# EAGLE design rev0.1 (EAGLE 7.2.0)
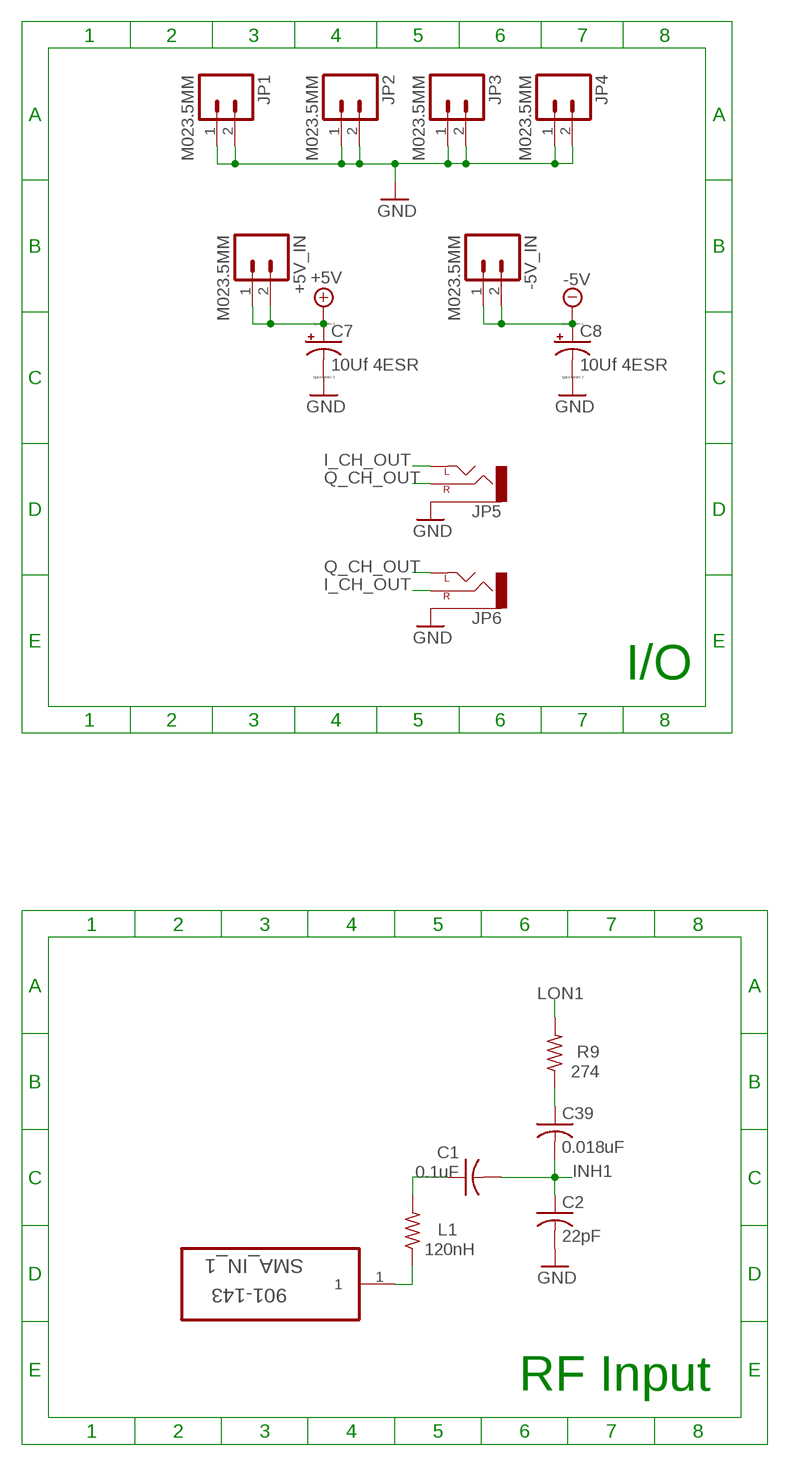
[diagram p0: schematic, sheet 1, part 1 of 2]
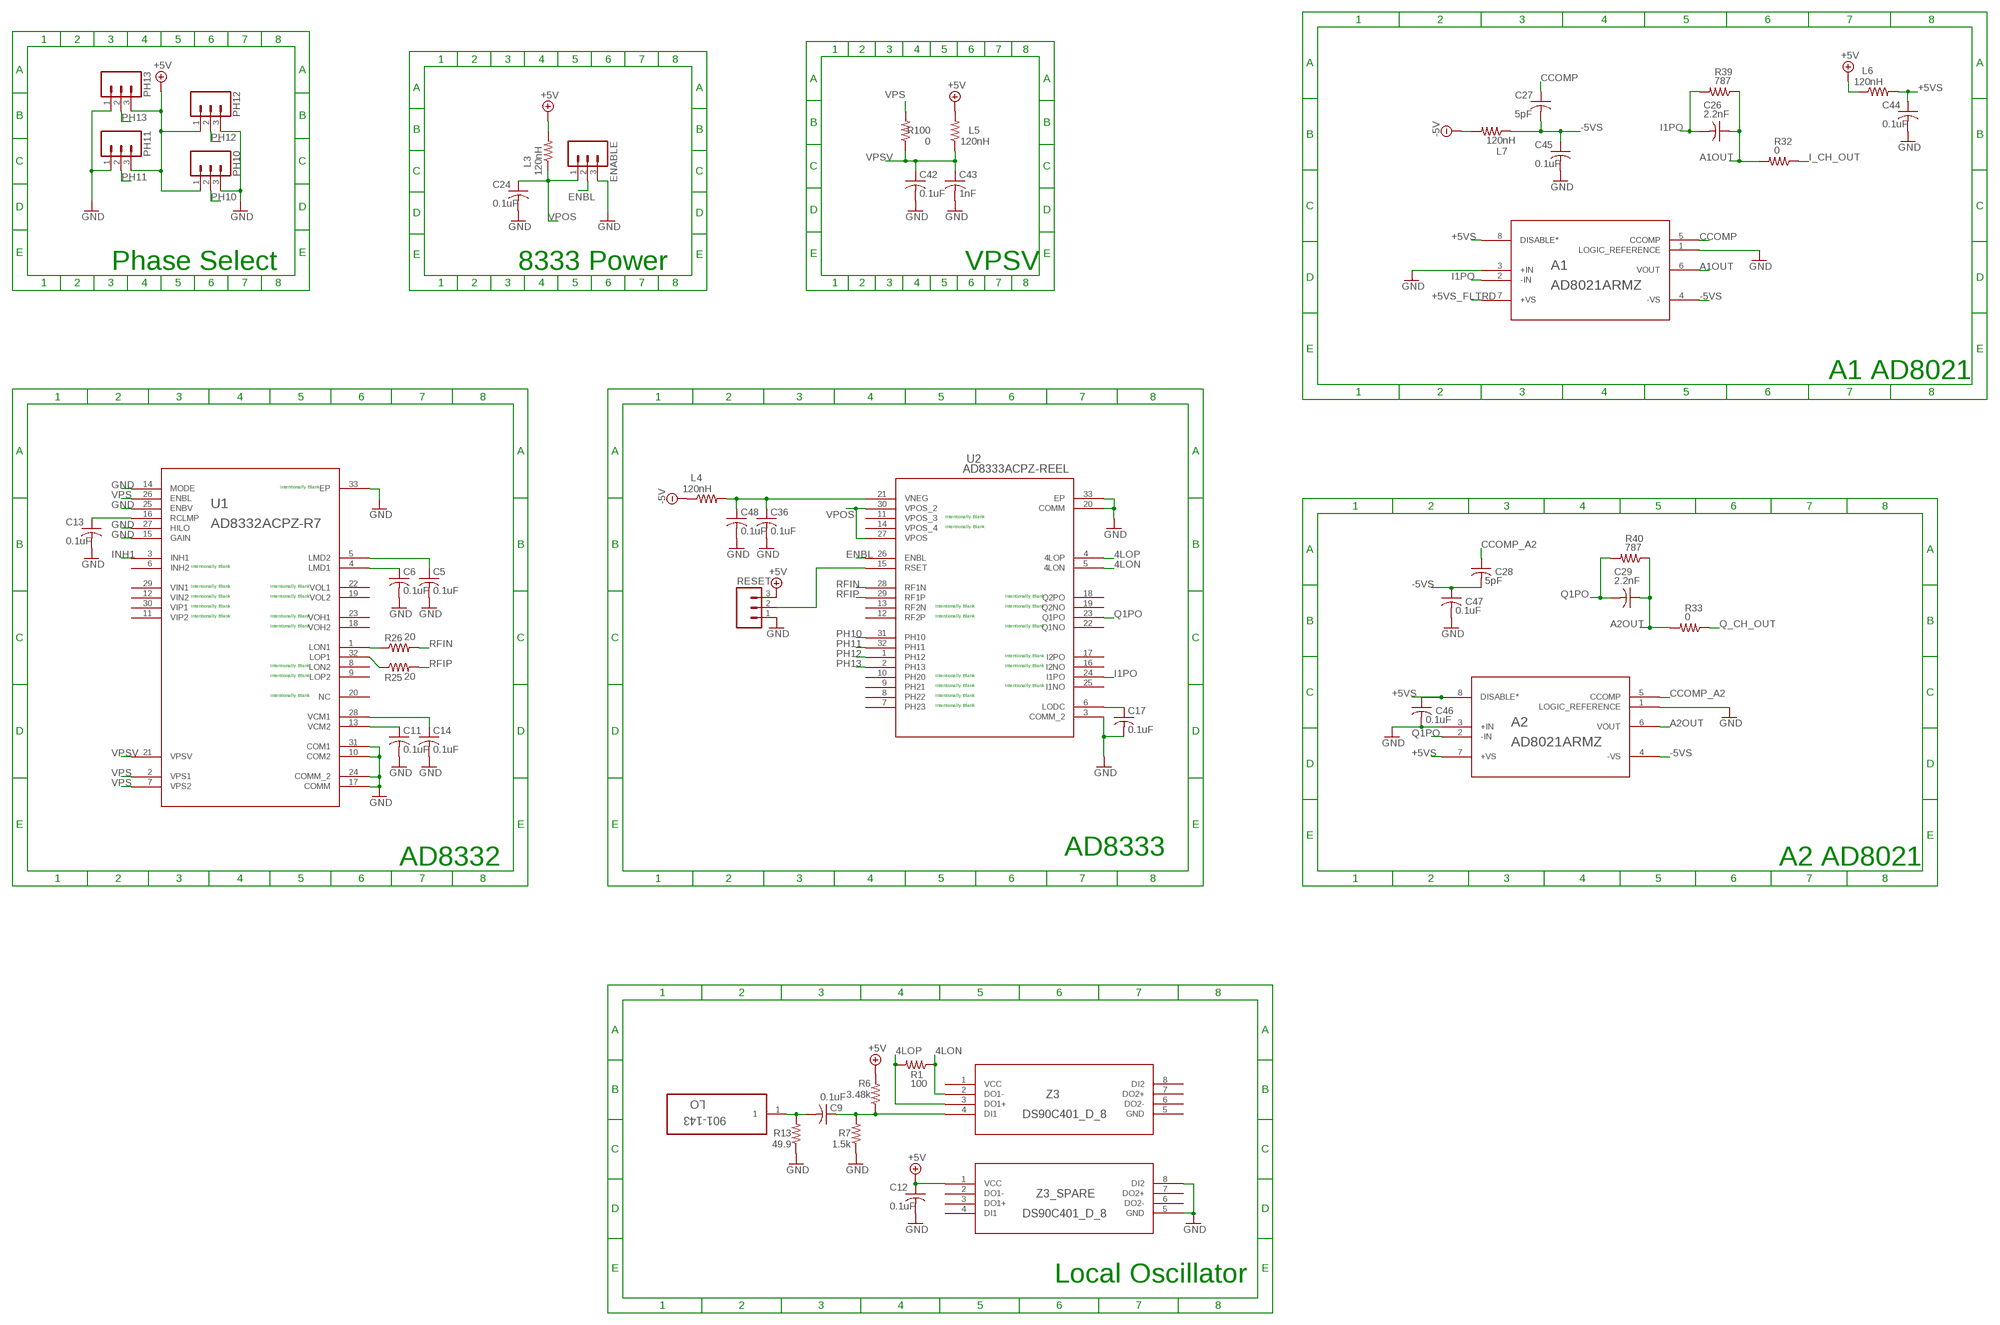
[diagram p1: schematic, sheet 1, part 2 of 2]

## Parts
+5V_IN  M023.5MM  [SCREWTERMINAL-3.5MM-2]
-5V_IN  M023.5MM  [SCREWTERMINAL-3.5MM-2]
A1  AD8021ARMZ  [RM_8]
A2  AD8021ARMZ  [RM_8]
C1  0.1uF  C-USC1206  [C1206]
C2  22pF  C-USC1206  [C1206]
C5  0.1uF  C-USC1206  [C1206]
C6  0.1uF  C-USC1206  [C1206]
C7  10Uf 4ESR  CPOL-USCT3216  [CT3216]
C8  10Uf 4ESR  CPOL-USCT3216  [CT3216]
C9  0.1uF  C-USC1206  [C1206]
C11  0.1uF  C-USC1206  [C1206]
C12  0.1uF  C-USC1206  [C1206]
C13  0.1uF  C-USC1206  [C1206]
C14  0.1uF  C-USC1206  [C1206]
C17  0.1uF  C-USC1206  [C1206]
C24  0.1uF  C-USC1206  [C1206]
C26  2.2nF  C-USC1206  [C1206]
C27  5pF  C-USC1206  [C1206]
C28  5pF  C-USC1206  [C1206]
C29  2.2nF  C-USC1206  [C1206]
C36  0.1uF  C-USC1206  [C1206]
C39  0.018uF  C-USC1206  [C1206]
C42  0.1uF  C-USC1206  [C1206]
C43  1nF  C-USC1206  [C1206]
C44  0.1uF  C-USC1206  [C1206]
C45  0.1uF  C-USC1206  [C1206]
C46  0.1uF  C-USC1206  [C1206]
C47  0.1uF  C-USC1206  [C1206]
C48  0.1uF  C-USC1206  [C1206]
ENABLE  M03PTH  [1X03]
JP1  M023.5MM  [SCREWTERMINAL-3.5MM-2]
JP2  M023.5MM  [SCREWTERMINAL-3.5MM-2]
JP3  M023.5MM  [SCREWTERMINAL-3.5MM-2]
JP4  M023.5MM  [SCREWTERMINAL-3.5MM-2]
JP5  AUDIO-JACKPTH  [AUDIO-JACK]
JP6  AUDIO-JACKPTH  [AUDIO-JACK]
L1  120nH  R-US_R0603  [R0603]
L3  120nH  R-US_R0603  [R0603]
L4  120nH  R-US_R0603  [R0603]
L5  120nH  R-US_R0603  [R0603]
L6  120nH  R-US_R0603  [R0603]
L7  120nH  R-US_R0603  [R0603]
LO  901-143  [AMPHENOL_901-143]
PH10  M03PTH  [1X03]
PH11  M03PTH  [1X03]
PH12  M03PTH  [1X03]
PH13  M03PTH  [1X03]
R1  100  R-US_R1206  [R1206]
R6  3.48k  R-US_R1206  [R1206]
R7  1.5k  R-US_R1206  [R1206]
R9  274  R-US_R1206  [R1206]
R13  49.9  R-US_R1206  [R1206]
R25  20  R-US_R1206  [R1206]
R26  20  R-US_R1206  [R1206]
R32  0  R-US_R1206  [R1206]
R33  0  R-US_R1206  [R1206]
R39  787  R-US_R1206  [R1206]
R40  787  R-US_R1206  [R1206]
R100  0  R-US_R1206  [R1206]
RESET  M03PTH  [1X03]
SMA_IN_1  901-143  [AMPHENOL_901-143]
U1  AD8332ACPZ-R7  [CP_32_2]
U2  AD8333ACPZ-REEL  [CP_32_2]
Z3  DS90C401_D_8  [M08A]
Z3_SPARE  DS90C401_D_8  [M08A]

## Nets
4LON: R1.1 U2.5(4LON) Z3.2(DO1-)
4LOP: R1.2 U2.4(4LOP) Z3.3(DO1+)
+5V: +5V_IN.1 +5V_IN.2 C7.-(+) C12.1 L3.2 L5.2 L6.1 PH10.1 PH11.3 PH12.1 PH13.3 R6.2 RESET.3 Z3_SPARE.1(VCC)
+5VS: A1.8(DISABLE*) A2.7(+VS) A2.8(DISABLE*) C44.1 C46.1 L6.2
+5VS_FLTRD: A1.7(+VS)
-5V: -5V_IN.1 -5V_IN.2 C8.-(+) L4.1 L7.2
-5VS: A1.4(-VS) A2.4(-VS) C27.2 C28.2 C45.1 C47.1 L7.1
A1OUT: A1.6(VOUT) C26.1 R32.2 R39.1
A2OUT: A2.6(VOUT) C29.1 R33.2 R40.1
CCOMP: A1.5(CCOMP) C27.1
CCOMP_A2: A2.5(CCOMP) C28.1
ENBL: ENABLE.2 U2.26(ENBL)
GND: A1.1(LOGIC_REFERENCE) A1.3(+IN) A2.1(LOGIC_REFERENCE) A2.3(+IN) C2.2 C5.2 C6.2 C7.+(-) C8.+(-) C11.2 C12.2 C13.2 C14.2 C17.2 C24.2 C36.2 C42.2 C43.2 C44.2 C45.2 C46.2 C47.2 C48.2 ENABLE.3 JP1.1 JP1.2 JP2.1 JP2.2 JP3.1 JP3.2 JP4.1 JP4.2 JP5.SLEEVE JP6.SLEEVE PH10.3 PH11.1 PH12.3 PH13.1 R7.1 R13.1 RESET.1 U1.10(COM2) U1.14(MODE) U1.15(GAIN) U1.17(COMM) U1.24(COMM_2) U1.25(ENBV) U1.27(HILO) U1.31(COM1) U1.33(EP) U2.3(COMM_2) U2.20(COMM) U2.33(EP) Z3_SPARE.5(GND) Z3_SPARE.8(DI2)
I1PO: A1.2(-IN) C26.2 R39.2 U2.24(I1PO)
I_CH_OUT: JP5.TIP(LEFT) JP6.RING(RIGHT) R32.1
INH1: C1.2 C2.1 C39.2 U1.3(INH1)
LMD1: C6.1 U1.4(LMD1)
LMD2: C5.1 U1.5(LMD2)
LON1: R9.2 R26.1 U1.1(LON1)
LOP1: R25.1 U1.32(LOP1)
N$1: C11.1 U1.13(VCM2)
N$2: C14.1 U1.28(VCM1)
N$3: C13.1 U1.16(RCLMP)
N$4: C1.1 L1.2
N$5: C9.1 R6.1 R7.2 Z3.4(DI1)
N$6: C39.1 R9.1
N$7: L1.1 SMA_IN_1.1
N$8: C9.2 LO.1 R13.2
N$9: C36.1 C48.1 L4.2 U2.21(VNEG)
N$10: C17.1 U2.6(LODC)
N$11: RESET.2 U2.15(RSET)
PH10: PH10.2 U2.31(PH10)
PH11: PH11.2 U2.32(PH11)
PH12: PH12.2 U2.1(PH12)
PH13: PH13.2 U2.2(PH13)
Q1PO: A2.2(-IN) C29.2 R40.2 U2.23(Q1PO)
Q_CH_OUT: JP5.RING(RIGHT) JP6.TIP(LEFT) R33.1
RFIN: R26.2 U2.28(RF1N)
RFIP: R25.2 U2.29(RF1P)
VPOS: C24.1 ENABLE.1 L3.1 U2.27(VPOS) U2.30(VPOS_2)
VPS: R100.2 U1.2(VPS1) U1.7(VPS2) U1.26(ENBL)
VPSV: C42.1 C43.1 L5.1 R100.1 U1.21(VPSV)
Unconnected: U1.6(INH2) U1.8(LON2) U1.9(LOP2) U1.11(VIP2) U1.12(VIN2) U1.18(VOH2) U1.19(VOL2) U1.20(NC) U1.22(VOL1) U1.23(VOH1) U1.29(VIN1) U1.30(VIP1) U2.7(PH23) U2.8(PH22) U2.9(PH21) U2.10(PH20) U2.11(VPOS_3) U2.12(RF2P) U2.13(RF2N) U2.14(VPOS_4) U2.16(I2NO) U2.17(I2PO) U2.18(Q2PO) U2.19(Q2NO) U2.22(Q1NO) U2.25(I1NO) Z3.6(DO2-) Z3.7(DO2+) Z3.8(DI2) Z3_SPARE.2(DO1-) Z3_SPARE.3(DO1+) Z3_SPARE.4(DI1) Z3_SPARE.6(DO2-) Z3_SPARE.7(DO2+)

## Notes on the sheet
- Phase Select | 8333 Power | VPSV
- A1 AD8021
- I/O
- Intentionally Blank
- Intentionally Blank
- Intentionally Blank
- Intentionally Blank
- Intentionally Blank | Intentionally Blank
- Intentionally Blank | Intentionally Blank | Intentionally Blank
- Intentionally Blank | Intentionally Blank | Intentionally Blank
- Intentionally Blank | Intentionally Blank | Intentionally Blank
- Intentionally Blank | Intentionally Blank
- Intentionally Blank
- Intentionally Blank | Intentionally Blank
- Intentionally Blank | Intentionally Blank
- Intentionally Blank | Intentionally Blank
- Intentionally Blank | Intentionally Blank
- Intentionally Blank
- RF Input | AD8333
- AD8332 | A2 AD8021
- Local Oscillator

## Power pins joined to a net without a drawn wire
GND: Z3.5(GND)
VCC: Z3.1(VCC)

## Library data of the parts
+5V_IN -5V_IN JP1-JP4 = SparkFun-Connectors:M02: Standard 2-pin 0.1" header. Use with - straight break away headers ( PRT-00116) - right angle break away headers (PRT-00553) - swiss pins (PRT-00743) - machine pins (PRT-00117) - female headers (PRT-00115) Molex polarized connector foot print use with: PRT-08233 with associated crimp pins and housings. 2.54_SCREWTERM for use with PRT-10571. 3.5mm Screw Terminal footprints for PRT-08084 5mm Screw Terminal footprints for use with PRT-08432
A1 A2 = ad8021:AD8021ARMZ; MANUFACTURER_PART_NUMBER: AD8021ARMZ; VENDOR: Vendor
C1 C2 C5 C6 C9 C11-C14 C17 C24 C26-C29 C36 C39 C42-C48 = resistor:C-US: CAPACITOR, American symbol
C7 C8 = resistor:CPOL-US: POLARIZED CAPACITOR, American symbol
ENABLE PH10-PH13 RESET = SparkFun-Connectors:M03: Header 3 Standard 3-pin 0.1" header. Use with straight break away headers (SKU : PRT-00116), right angle break away headers (PRT-00553), swiss pins (PRT-00743), machine pins (PRT-00117), and female headers (PRT-00115). Molex polarized connector foot print use with SKU : PRT-08232 with associated crimp pins and housings.
JP5 JP6 = SparkFun-Connectors:AUDIO-JACK: 3.5mm Audio Jack Simple 3.5mm common PCB mount audio jack. Variant PTH is our storefront SKU PRT-08032
L1 L3-L7 R1 R6 R7 R9 R13 R25 R26 R32 R33 R39 R40 R100 = resistor:R-US_: RESISTOR, American symbol
LO SMA_IN_1 = Amphenol_By_element14_Batch_1:901-143: RF/COAXIAL, SMA JACK, R/A, 50OHM, THD; MPN: 901-143; OC_FARNELL: 1461631; OC_NEWARK: 51F3841; PACKAGE: RF/COAXIAL, SMA JACK, R/A, 50OHM, THD; SUPPLIER: Amphenol
U1 = ad8332:AD8332ACPZ-R7; MANUFACTURER_PART_NUMBER: AD8332ACPZ-R7; VENDOR: Vendor
U2 = ad8333:AD8333ACPZ-REEL
Z3 Z3_SPARE = ds90c401:DS90C401_D_8; BASE_PN: DS90C401; COMPTYPE: Interface; PARTNUMBER: DS90C401M; SYMBOL: NameDS90C401M; TYPE: DS90C401M; VENDOR: NationalSemiconductor; VERSION: 05/02/2007

## Board
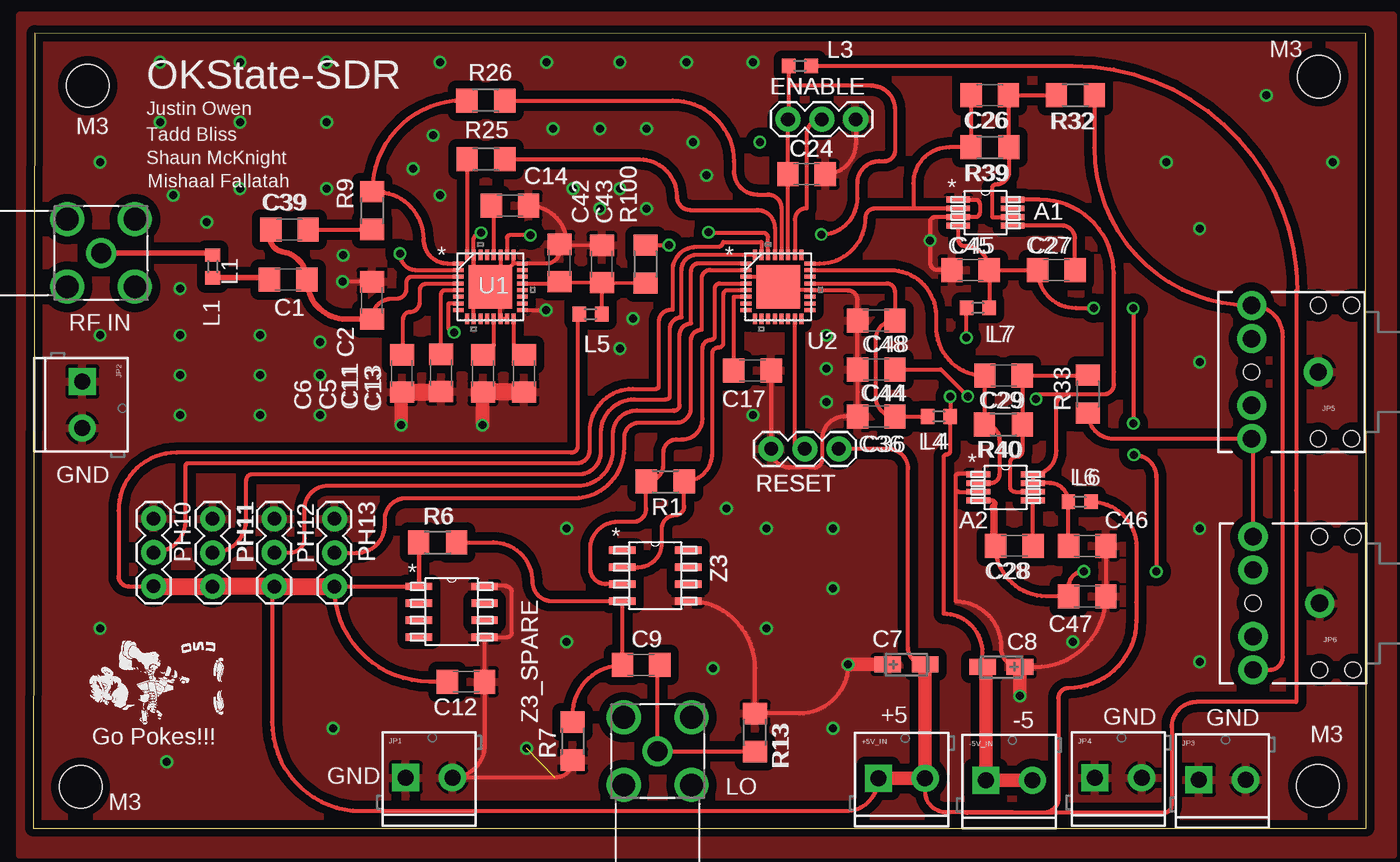
[diagram p2: board, top side]
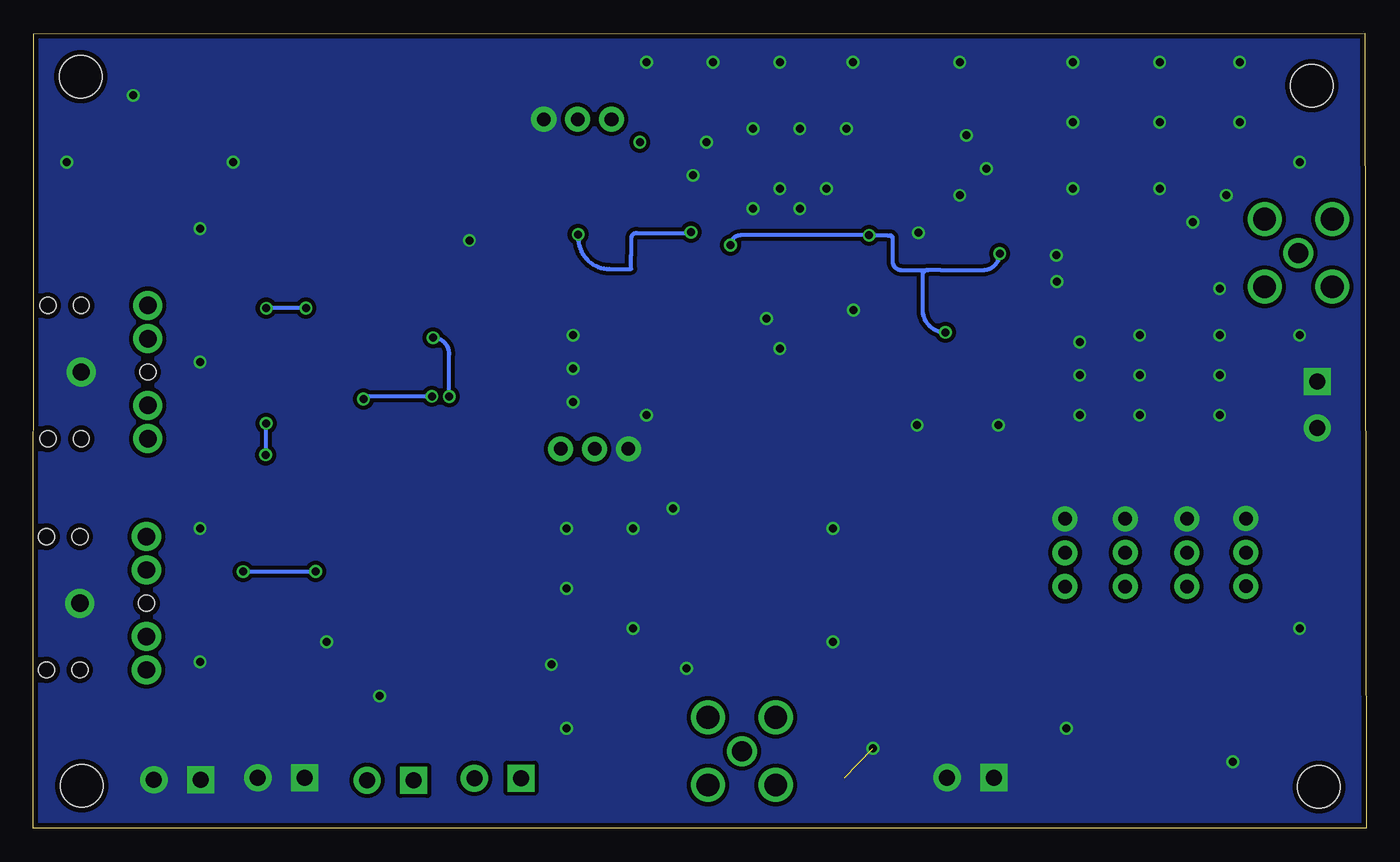
[diagram p3: board, bottom side, seen from below]

Size 100 x 59.66 mm. Coordinates in mm from the lower left corner, seen from the top.
Outline: 0,0 100,0 99.96,59.62 0.12,59.66 0,0
Copper layers (1*16): Top 0.0356mm / dielectric 1.5011mm / Bottom 0.0356mm
Design rules "LaenPCBOrder": minimum track width 6mil, minimum drill 13mil, track to track 6mil, track to pad 6mil, pad to pad 6mil, via to via 6mil, smd to smd 6mil, copper to edge 15mil, drill to drill 6mil, minimum pad ring 7mil, minimum via ring 7mil, stop-mask expansion 3mil, vias tented up to drill 0mil, thermal gap 10mil
Holes 3.2 mm at 4.09,55.74 3.54,3.1 96.36,3.2 96.44,56.4

### Footprints (pad centres in the part's own frame; a part is rotated, then mirrored left to right if it is on the bottom)
SCREWTERMINAL-3.5MM-2 = drill 1.2 pad 2.032 square: 1 0,0 | drill 1.2 pad 2.032: 2 3.5,0
RM_8 = smd 1.778 x 0.432: 1 -2.045,0.975; 2 -2.045,0.325; 3 -2.045,-0.325; 4 -2.045,-0.975; 5 2.045,-0.975; 6 2.045,-0.325; 7 2.045,0.325; 8 2.045,0.975
C1206 = smd 1.6 x 1.8: 1 -1.4,0; 2 1.4,0
CT3216 = smd 2 x 1.2: + -1.4,0; - 1.4,0
1X03 = drill 1.016 pad 1.88: 1 0,0; 2 2.54,0; 3 5.08,0
AUDIO-JACK = drill 1.3 pad 2.184: RING 5,5; RSH 5,2.5; SLEEVE 0,0; TIP 5,-5; TSH 5,-2.5 | hole 1.2: 0,5; -2.5,5; -2.5,-5; 0,-5; 5,0
R0603 = smd 1 x 1.1: 1 -0.85,0; 2 0.85,0
AMPHENOL_901-143 = drill 1.499: 1 0,0 | drill 1.702: 2 -2.54,2.54; 3 -2.54,-2.54; 4 2.54,-2.54; 5 2.54,2.54
R1206 = smd 1.6 x 1.803: 1 -1.422,0; 2 1.422,0
CP_32_2 = smd 0.813 x 0.305: 1 -2.4,1.75; 2 -2.4,1.25; 3 -2.4,0.75; 4 -2.4,0.25; 5 -2.4,-0.25; 6 -2.4,-0.75; 7 -2.4,-1.25; 8 -2.4,-1.75; 17 2.4,-1.75; 18 2.4,-1.25; 19 2.4,-0.75; 20 2.4,-0.25; 21 2.4,0.25; 22 2.4,0.75; 23 2.4,1.25; 24 2.4,1.75 | smd 0.305 x 0.813: 9 -1.75,-2.4; 10 -1.25,-2.4; 11 -0.75,-2.4; 12 -0.25,-2.4; 13 0.25,-2.4; 14 0.75,-2.4; 15 1.25,-2.4; 16 1.75,-2.4; 25 1.75,2.4; 26 1.25,2.4; 27 0.75,2.4; 28 0.25,2.4; 29 -0.25,2.4; 30 -0.75,2.4; 31 -1.25,2.4; 32 -1.75,2.4 | smd 3.251 x 3.251: 33 0,0
M08A = smd 1.981 x 0.559: 1 -2.464,1.905; 2 -2.464,0.635; 3 -2.464,-0.635; 4 -2.464,-1.905; 5 2.464,-1.905; 6 2.464,-0.635; 7 2.464,0.635; 8 2.464,1.905

### Placement (x,y rotation side)
+5V_IN  63.41,3.76 0 top
-5V_IN  71.46,3.6 0 top
A1  71.44,46.2 0 top
A2  72.95,25.58 0 top
C1  19.12,41.18 0 top
C2  25.4,39.62 90 top
C5  30.6,34.18 270 top
C6  27.65,34.15 270 top
C7  65.5,12.29 0 top
C8  72.62,12.1 180 top
C9  45.6,12.25 0 top
C11  33.73,34.15 270 top
C12  32.46,11.01 0 top
C13  36.81,34.15 270 top
C14  35.76,46.73 0 top
C17  53.95,34.36 0 top
C24  58.02,49.09 0 top
C26  71.76,55.03 180 top
C27  76.75,41.89 180 top
C28  73.6,21.21 180 top
C29  72.79,33.97 180 top
C36  63.24,30.91 180 top
C39  19.22,44.93 180 top
C42  39.49,42.43 90 top
C43  42.65,42.35 90 top
C44  63.24,34.44 180 top
C45  70.32,41.9 180 top
C46  79.07,21.2 0 top
C47  79.07,17.41 0 top
C48  63.24,38.12 180 top
ENABLE  56.62,53.21 0 top
JP1  27.94,3.81 0 top
JP2  3.68,33.53 270 top
JP3  87.45,3.64 0 top
JP4  79.65,3.79 0 top
JP5  96.41,34.24 180 top
JP6  96.51,16.89 180 top
L1  13.46,42.16 270 top
L3  57.52,57.22 0 top
L4  67.94,30.91 180 top
L5  41.8,38.59 180 top
L6  78.51,24.5 180 top
L7  70.87,39.05 180 top
LO  46.84,5.79 180 top
PH10  9.02,18.16 90 top
PH11  13.45,23.22 270 top
PH12  18.08,18.15 90 top
PH13  22.59,23.22 270 top
R1  47.41,26.02 180 top
R6  30.33,21.46 180 top
R7  40.47,6.54 90 top
R9  25.42,46.36 90 top
R13  54.15,7.19 270 top
R25  33.96,50.2 0 top
R26  33.95,54.62 0 top
R32  78.18,55.02 180 top
R33  79.12,32.59 90 top
R39  71.77,51.1 180 top
R40  72.78,30.31 180 top
R100  45.93,42.34 90 top
RESET  55.35,28.47 0 top
SMA_IN_1  5.08,43.18 90 top
U1  34.29,40.64 0 top
U2  55.88,40.64 0 top
Z3  46.66,18.96 0 top
Z3_SPARE  31.39,16.25 0 top

### Tracks (layer width: path | path; a pad name or v marks a point on that pad's centre or on a via)
4LON
  Top 0.305: U2.5 52.09,40.39 arc90 51.78,40.08 51.78,36.44 arc-90 51.43,36.09 arc90 50.94,35.6 50.94,28.13 arc-90 R1.1 48.83,24.16 arc-90 48.18,23.51 arc90 47.16,22.49 47.16,21.4 arc-90 45.35,19.59 Z3.2
4LOP
  Top 0.305: U2.4 arc-90 U2.4 | U2.4 51.5,40.89 arc90 51.13,40.52 51.13,36.94 arc-90 50.85,36.66 arc90 50.21,36.02 50.21,30.74 arc-90 48.65,29.18 48.24,29.18 arc90 47.28,28.22 47.28,27.31 arc-90 R1.2 arc90 R1.2 45.98,23.97 arc-90 45.02,23.01 43.84,23.01 arc90 41.79,20.96 41.79,19.5 arc90 42.97,18.32 Z3.3 | U2.4 arc-90 U2.4
+5V
  Top 0.305: C12.1 29.72,11.01 arc-90 PH13.3 28.91,18.14 arc90 Z3_SPARE.1 28.93,21.44 arc90 R6.2 28.91,18.16 arc-90 28.86,18.11 22.36,18.11 arc-90 22.18,18.29 18,18.29 arc90 17.91,18.2 17.91,7.98 arc90 24.59,1.3 60.95,1.3 arc90 +5V_IN.1 | C7.- arc-90 65.63,13.56 65.63,26.99 arc90 64.17,28.45 60.45,28.45 arc-90 RESET.3 | L6.1 arc-90 82.76,21.1 82.76,16.98 arc-90 82.75,16.97 82.75,15.62 arc-90 77.65,10.52 arc90 76.9,9.77 76.9,2.24 arc-90 75.84,1.18 73.54,1.18 arc90 73.53,1.19 70.04,1.19 | 70.04,1.19 69.93,1.19 | 69.93,1.19 68.52,1.19 arc-90 66.91,2.8 +5V_IN.2 | L5.2 arc90 40.84,38.48 40.84,28.66 arc-90 40.38,28.2 10.74,28.2 arc90 6.39,23.85 6.39,18.92 arc90 7.15,18.16 PH10.1 | L3.2 77.97,57.22 arc-90 94.82,40.37 arc90 94.75,40.3 94.75,25.37 94.74,9.48 87.29,9.48 arc90 85.4,7.59 85.4,1.71 arc-90 84.87,1.18 69.94,1.18 arc-90 69.93,1.19 | 70.07,1.16 arc-90 70.04,1.19
  Top 1.016: +5V_IN.1 +5V_IN.2 C7.- arc90 C7.-
  Top 1.27: PH10.1 13.43,18.16 arc-90 PH11.3 arc-90 PH11.3 PH12.1 PH13.3 arc-90 PH13.3
+5VS  (via drill 0.6)
  Top 0.305: A2.7 arc90 A2.7 | C46.1 L6.2 arc90 76.25,25.91 A2.7 | A2.7 A2.8 arc90 76.76,28.32 76.76,31.72 arc-90 77.62,32.58 | 77.62,32.58 80.34,32.58 arc90 81.08,33.32 81.08,34.26 arc-90 81.07,34.27 81.07,41.64 arc90 75.53,47.17 A1.8 | C44.1 68.08,34.44 v70.1,32.42 | v75.23,32.21 arc-90 75.6,32.58 77.62,32.58
  Bottom 0.305: v70.1,32.42 75.02,32.42 v75.23,32.21
-5V  (via drill 0.6)
  Top 0.305: C8.- 71.22,13.18 arc90 68.3,16.1 68.3,27.82 arc-90 68.54,28.06 arc90 68.79,28.31 L4.1 v68.79,32.4 | v70.01,36.81 L7.2 arc-90 L7.2
  Top 1.016: C8.- arc-90 71.46,11.86 -5V_IN.1 -5V_IN.2
  Bottom 0.305: v68.79,32.4 68.79,35.59 arc-90 v70.01,36.81
-5VS  (via drill 0.6)
  Top 0.305: C45.1 arc90 69.93,43.69 69.88,43.69 arc-90 69.39,44.17 A1.4 | C45.1 L7.1 | C45.1 arc90 C45.1 C27.2 arc90 78.19,39.05 v79.55,39.05 | 72.19,24.33 72.19,23.87 arc-90 72.2,23.86 C28.2 arc90 76,17.41 C47.1 77.67,18.13 arc-90 v78.82,19.28 | 72.19,24.33 arc90 71.92,24.6 A2.4 arc-90 A2.4 | v82.52,39.03 arc-90 82.54,39.01 v82.54,30.39 | 72.19,24.33 arc90 71.91,24.05 71.91,21.47 | v82.57,28.03 arc-90 84.25,26.35 v84.25,19.26
  Bottom 0.305: v79.55,39.05 arc90 79.57,39.03 v82.52,39.03 | v82.54,30.39 arc-90 82.57,30.36 v82.57,28.03 | v84.25,19.26 arc90 84.23,19.28 v78.82,19.28
A1OUT
  Top 0.305: A1.6 71.92,45.88 arc-90 71.92,45.88 71.92,47.98 arc-90 72.26,48.32 arc90 73.19,49.25 R39.1 arc-90 73.16,51.13 C26.1 arc90 C26.1 R32.2
A2OUT
  Top 0.305: A2.6 73.67,25.25 arc-90 73.28,25.64 73.28,27.43 arc-90 73.72,27.87 73.75,27.87 arc90 74.2,28.32 R40.1 74.2,33.96 arc90 C29.1 79.08,33.97 arc90 R33.2
CCOMP
  Top 0.305: C27.1 78.15,44.26 arc90 77.18,45.23 A1.5 arc90 A1.5
CCOMP_A2
  Top 0.305: C28.1 arc-90 C28.1 A2.5
ENBL
  Top 0.305: ENABLE.2 arc90 58.01,52.06 58.01,46.53 arc90 57.13,45.65 U2.26
GND  (via drill 0.6)  (1 unrouted)
  Top 0.305: U1.10 33.04,39.39 arc-90 U1.33 | U1.31 | U1.31 33.04,42.17 33.44,41.77 33.44,41.6 34.29,40.75 U1.33 | 36.04,42.39 U1.24 38.7,42.39 arc90 C42.2 | 36.04,42.39 U1.25 | U1.27 | U1.27 35.04,42.1 | 36.04,42.39 35.76,42.11 | 35.76,42.11 35.76,42.09 | U1.33 35,39.93 35,39.12 arc-90 35.04,39.09 U1.14 U1.15 arc-90 35.51,38.21 35.08,38.21 arc-90 35.02,38.27 35.02,40.4 arc90 33.37,42.05 33.11,42.05 arc-90 33.02,42.14 33.02,44.11 arc-90 v33.6,44.69 | 35.76,42.11 arc-90 35.75,42.1 35.04,42.1 | 35.04,42.1 arc90 34.29,41.35 U1.33 | C2.2 v23.21,41.02 | C43.2 40.03,43.72 arc90 C42.2 | C14.2 arc-90 40.01,43.88 C42.2 | C12.2 arc-90 C12.2 | C12.2 Z3_SPARE.5 35.53,14.35 arc90 35.89,14.7 35.89,17.75 arc90 35.46,18.18 33.88,18.18 arc90 Z3_SPARE.8 | C12.2 33.85,6.22 arc-90 JP1.2 39.16,3.81 arc90 R7.1 | Z3.5 arc-90 54.15,12.03 R13.1 57.45,8.61 arc90 v61.13,12.29 | ENABLE.3 61.7,51.37 arc-90 C24.2 | U2.3 55.89,41.39 55.89,41.37 55.88,41.37 U2.33 55.88,40.39 U2.20 arc90 58.32,40.35 61.14,40.35 arc-90 61.84,39.65 C48.2 C44.2 C36.2 60.91,30.91 arc90 59.17,29.17 59.17,27.64 arc-90 58.6,27.07 56.75,27.07 arc-90 RESET.1 C17.2 | A1.1 arc90 A1.1 70.72,47.17 arc-90 71,46.89 71,46.16 arc-90 70.72,45.88 A1.3 67.67,45.88 arc90 67.28,45.49 v67.28,44.12 arc-90 67.3,44.1 67.3,42.43 arc90 67.83,41.9 C45.2 | A2.1 arc90 70.86,26.6 69.4,26.6 arc90 69.19,26.39 69.19,25.51 | 69.19,25.51 arc90 69.44,25.25 A2.3 | C46.2 C47.2 arc-90 75.16,12.1 C8.+ | C8.+ arc-90 74.04,12.08 74.04,9.84 | 69.19,25.51 69.19,17.04 arc90 69.2,17.03 69.21,17.03 arc-90 72.6,13.64 72.6,13.52 arc90 C8.+ | U1.17 v38.46,38.89 arc90 v38.47,38.9
  Top 1.016: v27.6,30.25 27.6,32.7 arc-90 C6.2 | v33.69,30.25 33.69,32.7 arc-90 C11.2 | v61.13,12.29 C7.+ | v74.02,9.93 C8.+
  Top 1.27: C6.2 30.57,32.74 arc90 C5.2 | C13.2 C11.2
  other vias: 9.5,57.5 15.5,57.5 22,57.5 30.5,57.5 9.5,53 15.5,53 22,53 5,50 10.5,47.5 15.5,48 13,45.5 22,48 30,52 28.5,49.5 30.5,47.5 38.5,57.5 39,52.5 44,57.5 49,57.5 54,57.5 42.5,52.5 46,52.5 49.5,51.5 50.5,49 85,50 40.5,48 42.5,46.5 44,48 46,46.5 92.5,55 97.5,50 87.5,45 87.5,35 59.5,37 59.5,34.5 59.5,32 54,31 45,38.25 44,36 23.25,43 11,40.5 11,37 11,34 11,31 17,37 17,34 17,31 21.5,36.5 21.5,34 21.5,31 5,37 5,15 22.5,7.5 40,22.5 40,14 52,24 55,22.5 60,22.5 60,18 55,15 51,12 60,7.5 78,14 87.5,22.5 87.5,12.5 10,5 37,6
  pour Bottom (isolate 0.305, no thermals): 0.05,59.62 100.02,59.73 100.33,0 0,0
  pour Top (isolate 0.61): -1,61 102,61 102,-2 -1,-2
I1PO
  Top 0.305: U2.24 59.01,42.39 arc90 62.44,45.82 arc-90 63.15,46.52 66.02,46.52 | 66.02,46.52 A1.2 | 66.02,46.52 66.02,48.4 arc-90 68.72,51.1 R39.2 arc90 70.36,51.11 C26.2
I_CH_OUT
  Top 0.305: R32.1 79.6,51.05 arc90 JP5.TIP arc-90 93.75,36.9 93.75,12.89 arc-90 92.75,11.89 JP6.RING
INH1
  Top 0.305: C2.1 arc-90 26.93,39.75 27.25,39.75 arc90 28,40.5 28,41 arc-90 28.39,41.39 U1.3
  Top 0.406: C2.1 23.48,38.22 arc-90 C1.2 arc81 18.75,43.25 arc-104 C39.2
LMD1
  Top 0.305: C6.1 arc90 27.75,35.77 27.75,38.25 arc-90 28.25,38.75 arc90 29,39.5 29,40.38 arc-90 29.5,40.88 31.88,40.88 arc90 U1.4
LMD2
  Top 0.305: C5.1 30.6,40.1 arc-90 30.88,40.38 31.88,40.38 arc90 U1.5
LON1
  Top 0.305: U1.1 31.08,42.39 arc-90 29.27,44.2 arc90 25.69,47.78 R9.2 arc-90 32.26,54.62 R26.1
LOP1
  Top 0.305: R25.1 arc-90 R25.1 U1.32
N$1
  Top 0.305: U1.13 34.54,36.35 arc-90 C11.1
N$2
  Top 0.305: C14.1 arc90 34.54,46.62 U1.28
N$3
  Top 0.305: U1.16 36.04,36.31 arc90 C13.1
N$4
  Top 0.406: L1.2 17.72,41.31 C1.1
N$5
  Top 0.305: C9.1 44.2,12.5 | C9.1 Z3.4 arc90 Z3.4 38.91,17.05 arc-90 37.44,18.53 arc90 34.51,21.46 R6.1 | R7.2 40.47,8.52 arc-90 C9.1
N$6
  Top 0.305: C39.1 arc-90 C39.1 R9.1
N$7
  Top 0.406: SMA_IN_1.1 13.46,43.18 L1.1
N$8
  Top 0.305: 47.02,12.23 arc-90 C9.2 arc90 46.84,12.09 LO.1 54.13,5.79 arc-90 R13.2
N$9
  Top 0.305: U2.21 64.03,40.89 arc-90 64.64,40.28 C48.1 arc90 63.22,36.7 63.22,32.33 arc90 C36.1 L4.2
N$10
  Top 0.305: C17.1 52.55,39.89 U2.6
N$11
  Top 0.305: RESET.2 57.13,28.47 U2.15
N$14  (via drill 0.6)
  other vias: 54.5,51.5
PH10
  Top 0.305: 54.63,43.16 U2.31 | PH10.2 arc90 11.44,23.12 11.44,27.25 arc-90 11.59,27.4 40.76,27.4 arc90 41.75,28.39 41.75,29.77 arc-90 44.96,32.98 46.75,32.98 arc90 46.78,33.01 arc90 46.93,33.16 46.93,38.01 arc-90 47.84,38.92 47.98,38.92 47.98,41.88 arc-90 49.74,43.64 51.39,43.64 arc90 51.76,44.01 54.62,44.01 arc90 54.63,44.02 U2.31 | U2.31 arc-90 U2.31
PH11
  Top 0.305: PH11.2 arc90 15.98,23.21 15.98,26.13 arc-90 16.43,26.58 40.92,26.58 arc90 42.59,28.25 42.59,29.69 arc-90 45.09,32.19 47.44,32.19 arc90 47.46,32.21 47.52,32.21 arc90 47.76,32.45 47.76,37.47 arc-90 48.64,38.35 48.64,41.9 arc-90 49.79,43.05 U2.32 arc-90 U2.32
PH12
  Top 0.305: PH12.2 19.27,20.69 arc90 20.36,21.78 20.36,23.98 arc-90 22.1,25.72 40.81,25.72 arc-90 40.82,25.71 arc90 43.49,28.38 43.49,29.59 arc-90 45.26,31.36 48.03,31.36 arc-90 48.06,31.33 arc90 48.49,31.76 48.49,37.02 arc-90 49.36,37.89 49.36,41.85 arc-90 49.91,42.4 U2.1 arc-90 U2.1
PH13
  Top 0.305: PH13.2 24.28,20.68 arc90 26.38,22.78 26.38,23.19 arc-90 27.98,24.79 40.58,24.79 arc90 44.34,28.55 44.34,29.33 arc-90 45.46,30.45 48.28,30.45 arc90 49.33,31.5 49.33,36.6 arc-90 50.15,37.42 50.15,41.27 arc-90 50.78,41.9 U2.2 arc-90 U2.2
Q1PO
  Top 0.305: U2.23 64.3,41.89 arc-90 67.72,38.47 67.72,37.64 arc90 C29.2 arc90 71.36,33.94 R40.2 arc-90 72.48,29.19 72.48,26.55 arc-90 71.83,25.91 A2.2
Q_CH_OUT
  Top 0.305: R33.1 arc90 81.05,29.24 JP5.RING arc-90 91.51,29.14 JP6.TIP
RFIN
  Top 0.305: U2.28 arc-90 U2.28 56.12,46.55 arc90 55.1,47.57 54.3,47.57 arc-90 52.56,49.31 52.56,50.03 arc90 47.97,54.62 R26.2
RFIP
  Top 0.305: R25.2 45.49,50.2 arc-90 48.28,47.41 arc90 49.28,46.41 54.27,46.41 arc-90 55.63,45.05 U2.29
VPOS  (via drill 0.6)
  Top 0.305: U2.27 arc-90 U2.27 C24.1 ENABLE.1 arc90 56.67,53.26 56.67,55.67 | L3.1 56.67,55.67 | U2.30 55.13,44.33 arc90 54.78,44.68 50.7,44.68 arc-90 v50.65,44.73 | v59.12,44.57 arc90 61.84,47.29 61.84,48.44 arc-90 63.47,50.07 63.86,50.07 arc90 64.67,50.88 64.67,53.92 arc90 62.87,55.72 56.72,55.72 arc90 56.67,55.67
  Bottom 0.305: v59.12,44.57 59.12,44.32 arc-90 56.77,41.97 55.17,41.97 arc-90 55.14,42 U2.30 arc90 U2.30 55.13,44.28 arc90 54.73,44.68 50.7,44.68 arc-90 v50.65,44.73
VPS  (via drill 0.6)
  Top 0.305: v27.5,43.13 arc90 28.74,41.89 U1.2 | v37.29,44.5 35.72,44.5 arc90 35.54,44.32 U1.26 | U1.26 arc90 U1.26 | R100.2 arc90 46.6,43.76 v47.69,43.76 | U1.7 31.21,39.39 | 31.21,39.39 arc-90 31.21,39.39 | 31.21,39.39 arc90 31.12,39.3 31.12,37.67 arc90 v31.57,37.22
  Bottom 0.305: 32.91,41.89 34.86,41.89 arc90 35.54,42.57 35.54,44.31 arc-90 35.72,44.49 35.9,44.49 arc-90 35.91,44.5 v37.29,44.5 46.95,44.5 arc-90 v47.69,43.76 | U1.2 arc-90 U1.2 | U1.2 28.74,41.89 arc-90 v27.5,43.13 | U1.2 32.91,41.89 | 32.91,41.89 arc-90 33.29,41.51 33.29,38.94 arc-90 v31.57,37.22
VPSV
  Top 0.305: U1.21 40,40.89 arc90 C42.1 arc-90 40.03,40.92 C43.1 | C43.1 46.6,40.92 arc-90 R100.1 | L5.1 C43.1

### Text on the board
tPlace: M3 | L3 | OKState-SDR | R26 | ENABLE | Justin Owen | M3 | Tadd Bliss | R25 | C26 | R32 | Shaun McKnight | C24 | C24 | R39 | R39 | Mishaal Fallatah | C14 | C39 | R9 | A1 | C42 | C43 | R100 | C45 | C27 | L1 | C1 | RF IN | L5 | U2 | C48 | L7 | C2 | C17 | C44 | C6 | C5 | C11 | C13 | C29 | R33 | C36 | L4 | R40 | GND | L6 | RESET | R6 | R1 | A2 | C46 | PH10 | PH11 | PH12 | PH13 | C28 | Z3 | C47 | C9 | C7 | C8 | C12 | Z3_SPARE | +5 | GND | GND | /home/justin/Desktop/Pistol_Pete.bmp | -5 | Go Pokes!!! | M3 | R7 | R13 | GND | LO | M3